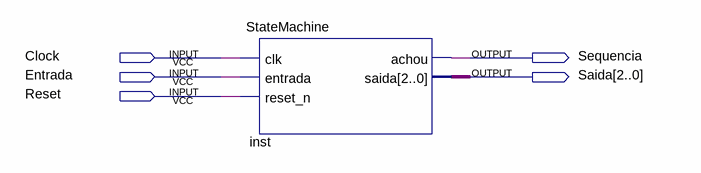
[diagram p0: schematic sheet]
// Quartus schematic LAB6.bdf as structural Verilog: 1 symbols, 5 pins
module LAB6 (
  input  Clock,
  input  Entrada,
  input  Reset,
  output Sequencia,
  output [2:0] Saida
);

  StateMachine inst (.clk(Clock), .entrada(Entrada), .reset_n(Reset), .achou(Sequencia), .saida(Saida));
endmodule
